# Altium schematic sheet Filter.SchDoc: Filter & amplification
size A4; Author: Jose Luis Llorente Gonzalez; CompanyName: ETSIT; Organization: UPM; Revision: V1.0
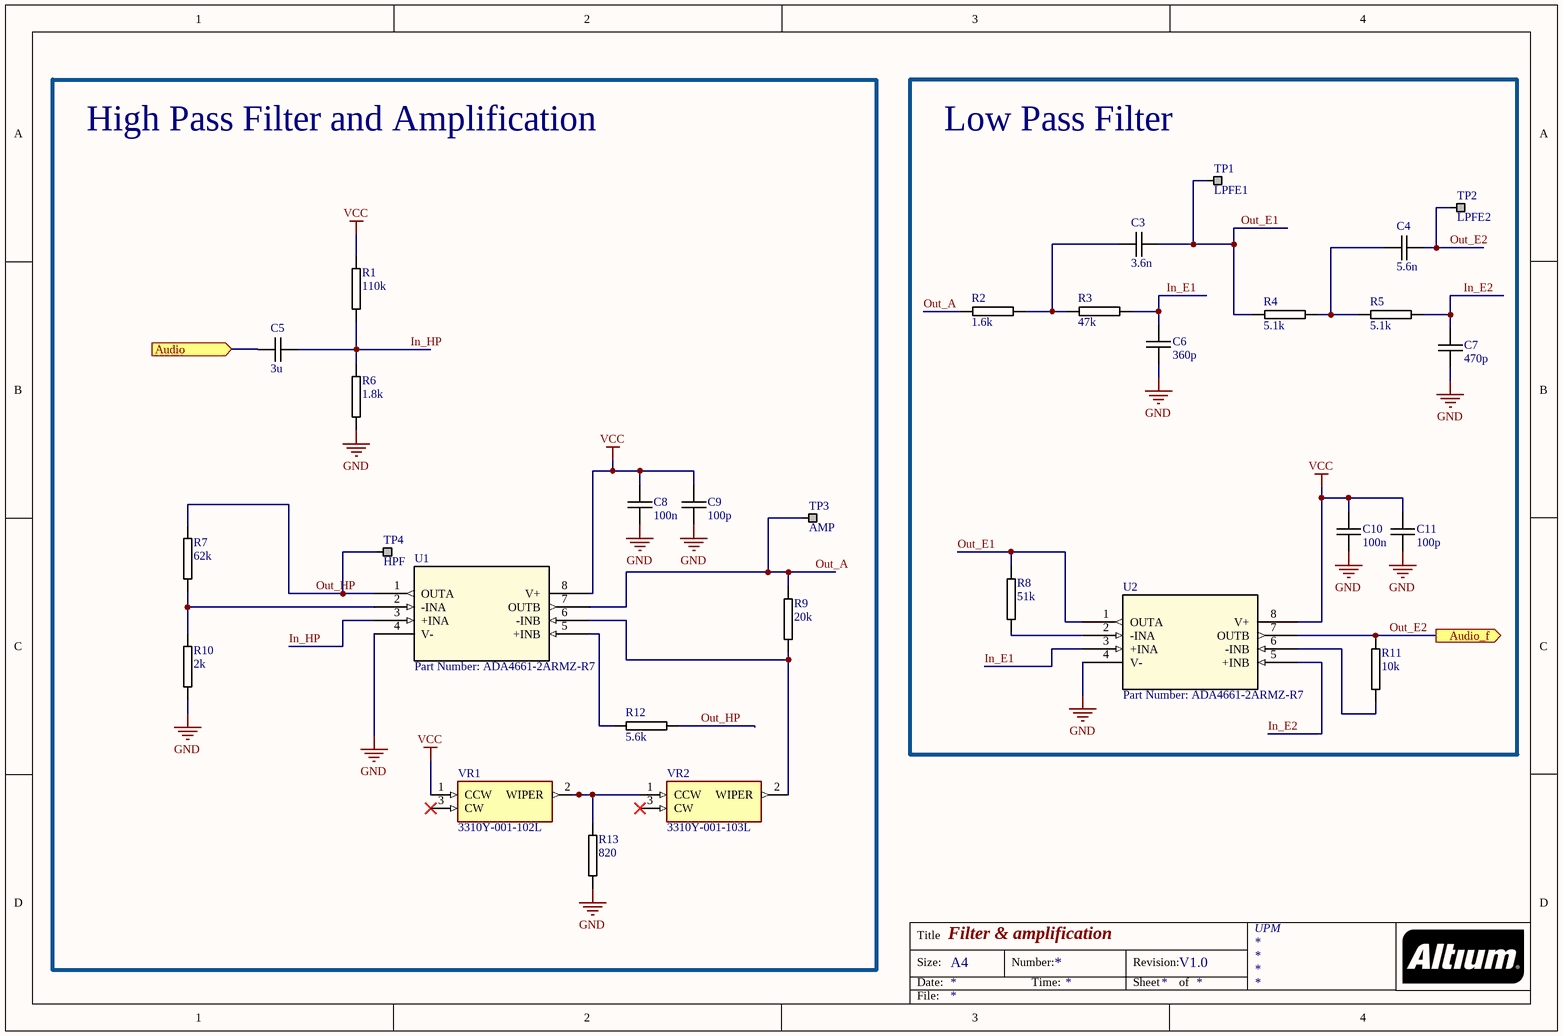
[diagram p0: Filter.SchDoc]

## Parts
C3  3.6n  [0805C-GENERIC]
C4  5.6n  [0805C-GENERIC]
C5  3u  [0805C-GENERIC]
C6  360p  [0805C-GENERIC]
C7  470p  [0805C-GENERIC]
C8  100n  [0805C-GENERIC]
C9  100p  [0805C-GENERIC]
C10  100n  [0805C-GENERIC]
C11  100p  [0805C-GENERIC]
R1  110k  [0805R-GENERIC]
R2  1.6k  [0805R-GENERIC]
R3  47k  [0805R-GENERIC]
R4  5.1k  [0805R-GENERIC]
R5  5.1k  [0805R-GENERIC]
R6  1.8k  [0805R-GENERIC]
R7  62k  [0805R-GENERIC]
R8  51k  [0805R-GENERIC]
R9  20k  [0805R-GENERIC]
R10  2k  [0805R-GENERIC]
R11  10k  [0805R-GENERIC]
R12  5.6k  [0805R-GENERIC]
R13  820  [0805R-GENERIC]
TP1  LPFE1  [TESTPIN]
TP2  LPFE2  [TESTPIN]
TP3  AMP  [TESTPIN]
TP4  HPF  [TESTPIN]
U1  Part Number: ADA4661-2ARMZ-R7  [RM_8]
U2  Part Number: ADA4661-2ARMZ-R7  [RM_8]
VR1  3310Y-001-102L  [3310Y-001]
VR2  3310Y-001-103L  [3310Y-001]

## Blocks framed on the sheet
High Pass Filter and Amplification: C5 C8 C9 R1 R6 R7 R9 R10 R12 R13 TP3 TP4 U1 VR1 VR2
Low Pass Filter: C3 C4 C6 C7 C10 C11 R2-R5 R8 R11 TP1 TP2 U2

## Ports
Audio (in), Audio_f (out)

## Nets
GND: C6.1 C7.1 C8.2 C9.2 C10.2 C11.2 R6.2 R10.2 R13.2 U1.4(V-) U2.4(V-)
VCC: C8.1 C9.1 C10.1 C11.1 R1.1 U1.8(V+) U2.8(V+) VR1.1(CCW)
Audio: C5.1 ; port Audio
In_E1: C6.2 R3.2 U2.3(+INA)
In_E2: C7.2 R5.2 U2.5(+INB)
In_HP: C5.2 R1.2 R6.1 U1.3(+INA)
Out_A: R2.1 R9.1 TP3.1 U1.7(OUTB)
Out_E1: C3.2 R4.1 R8.1 TP1.1 U2.1(OUTA)
Out_E2: C4.2 R11.1 TP2.1 U2.7(OUTB) ; port Audio_f
Out_HP: R7.1 R12.2 TP4.1 U1.1(OUTA)
NetC3_1: C3.1 R2.2 R3.1
NetC4_1: C4.1 R4.2 R5.1
NetR7_2: R7.2 R10.1 U1.2(-INA)
NetR8_2: R8.2 U2.2(-INA)
NetR9_2: R9.2 U1.6(-INB) VR2.2(WIPER)
NetR11_2: R11.2 U2.6(-INB)
NetR12_1: R12.1 U1.5(+INB)
NetR13_1: R13.1 VR1.2(WIPER) VR2.1(CCW)

Not connected (* = marked no-connect by the designer): VR1 3(CW)*; VR2 3(CW)*

## Notes on the sheet
- Title
- Size:
- Date:
- A4
- Number:
- Time:
- Revision:
- Sheet
- of
- File:

## Library data of the parts
C3-C11 = C0805-GENERIC: GENERIC CAPACITOR NON POLARISED0603
R1-R13 = R0805-GENERIC: GENERIC RESISTOR 0805
TP1-TP4 = TESTPIN: TESTPIN SINGLE PIN HEADER; Manufacturer 1: Sharon Long Industries; Manufacturer Part Number 1: Cut-it-yourself; Reel: TH; Supplier 1: Sharon Long Industries; Supplier 1 Part number: Cut-It-Yourself
U1 U2 = ADA4661-2ARMZ-R7: No Description Available; Built_By: EMA_Christopher; Vendor: Analog Devices Inc; Copyright: Copyright (C) 2016 Accelerated Designs. All rights reserved; Manufacturer_Part_Number: ADA4661-2ARMZ-R7; RefDes: RefDes; Type: DEV; Value: Value
VR1 VR2 = 3310Y-001-103L: Variable Resistor; Manufacturer_Name: Bourns; Datasheet Link: http://www.bourns.com/docs/Product-Datasheets/3310.pdf; Manufacturer_Part_Number: 3310Y-001-103L; Mouser Part Number: 652-3310Y-001-103L; Mouser Price/Stock: https://www.mouser.com/Search/Refine.aspx?Keyword=652-3310Y-001-103L; RS Part Number: 5220625P; RS Price/Stock: http://uk.rs-online.com/web/p/products/5220625P